# EAGLE design TPS6300x (EAGLE 6.2)
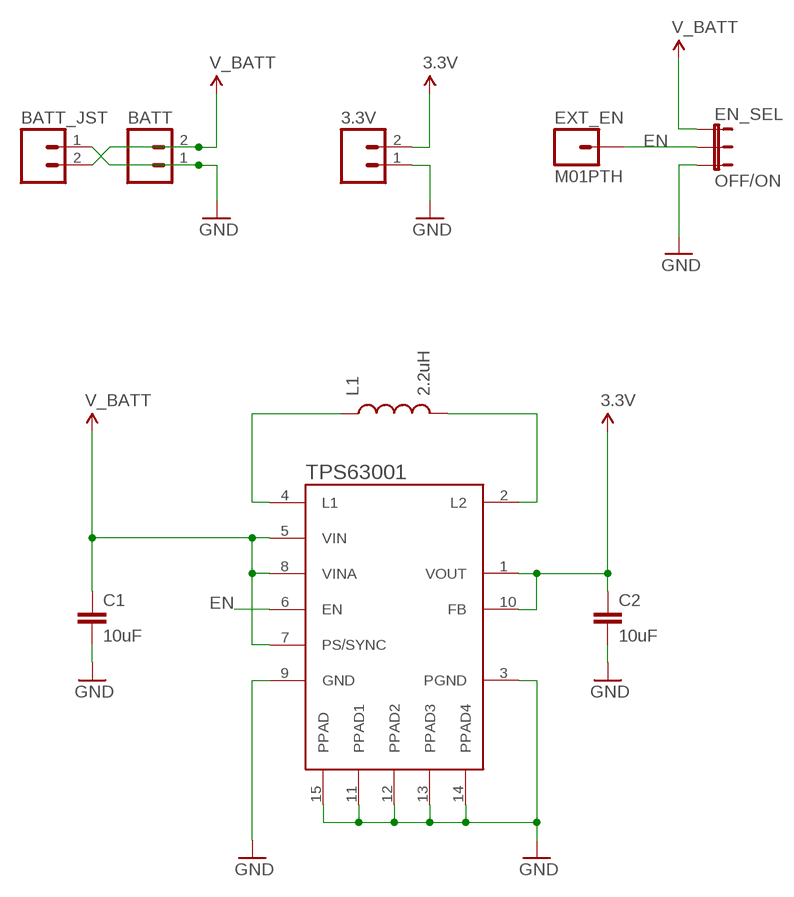
[diagram p0: schematic, sheet 1]

## Parts
3.3V  M02PTH  [1X02]
BATT  M02PTH  [1X02]
BATT_JST  M02-JST-2MM-SMT  [JST-2-SMD]
C1  10uF  CAP_CER-2012(0805)  [CAP-2012]
C2  10uF  CAP_CER-2012(0805)  [CAP-2012]
EN_SEL  OFF/ON  JUMPER-3SMD  [SJ_3]
EXT_EN  M01PTH  [1X01]
L1  2.2uH  INDUCTOR-VLF4012A  [INDUCTOR-VLF4012A]
TPS63001  TPS6300X  [QFN-10_PAD]

## Nets
1.8V: BATT.2 BATT_JST.2 C1.+ EN_SEL.1 TPS63001.5(VIN) TPS63001.7(PS/SYNC) TPS63001.8(VINA) ; supply symbol labelled V_BATT
3.3V: 3.3V.2 C2.+ TPS63001.1(VOUT) TPS63001.10(FB)
EN: EN_SEL.2 EXT_EN.1 TPS63001.6(EN)
GND: 3.3V.1 BATT.1 BATT_JST.1 C1.- C2.- EN_SEL.3 TPS63001.3(PGND) TPS63001.9(GND) TPS63001.11(PPAD1) TPS63001.12(PPAD2) TPS63001.13(PPAD3) TPS63001.14(PPAD4) TPS63001.15(PPAD)
N$1: L1.2 TPS63001.4(L1)
N$2: L1.1 TPS63001.2(L2)

## Library data of the parts
3.3V BATT BATT_JST = SparkFun-Connectors:M02: Header 2 Standard 2-pin 0.1" header. Use with straight break away headers (SKU : PRT-00116), right angle break away headers (PRT-00553), swiss pins (PRT-00743), machine pins (PRT-00117), and female headers (PRT-00115). Molex polarized connector foot print use with SKU : PRT-08233 with associated crimp pins and housings.
C1 C2 = OpenSpace:CAP_CER
EN_SEL = SparkFun-Passives:JUMPER-3
EXT_EN = SparkFun-Connectors:M01: Header 1 Standard 1-pin 0.1" header. Use with straight break away headers (SKU : PRT-00116), right angle break away headers (PRT-00553), swiss pins (PRT-00743), machine pins (PRT-00117), and female headers (PRT-00115).
L1 = OpenSpace:INDUCTOR
TPS63001 = OpenSpace:TPS6300X

## Board
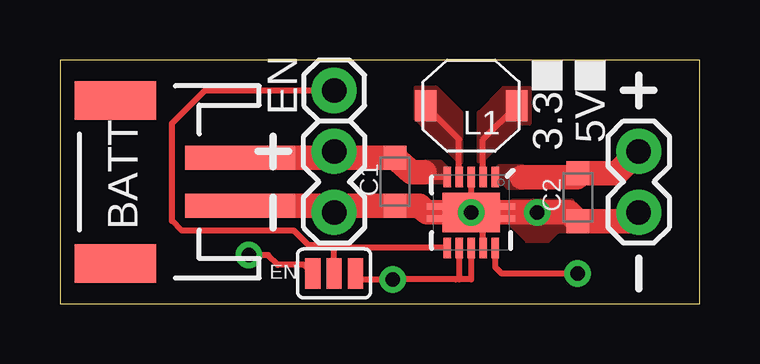
[diagram p1: board, top side]
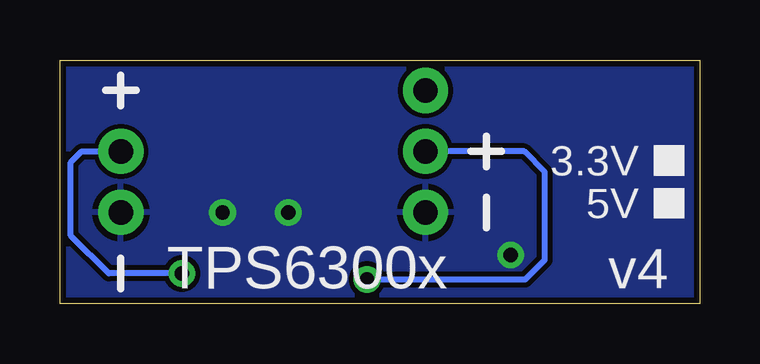
[diagram p2: board, bottom side, seen from below]

Size 26.67 x 10.16 mm. Coordinates in mm from the lower left corner, seen from the top.
Outline: 0,0 26.67,0 26.67,10.16 0,10.16 0,0
Copper layers (1*16): Top 0.035mm / dielectric 1.5mm / Bottom 0.035mm
Design rules: minimum track width 8mil, minimum drill 20mil, track to track 8mil, track to pad 8mil, pad to pad 8mil, via to via 8mil, smd to smd 8mil, copper to edge 10mil, drill to drill 8mil, minimum pad ring 12mil, minimum via ring 10mil, stop-mask expansion 4mil, vias tented up to drill 25mil, thermal gap 10mil

### Footprints (pad centres in the part's own frame; a part is rotated, then mirrored left to right if it is on the bottom)
1X02 = drill 1.016 pad 1.88: 1 0,0; 2 2.54,0
JST-2-SMD = smd 1 x 4.6: 1 -1,-3.7; 2 1,-3.7 | smd 1.6 x 3.4: NC1 -3.4,1.5; NC2 3.4,1.5
CAP-2012 = smd 1 x 0.95: + 1,0; - -1,0
SJ_3 = smd 0.635 x 1.27: 1 -0.889,0; 2 0,0; 3 0.889,0
1X01 = drill 1.016 pad 1.88: 1 0,0
INDUCTOR-VLF4012A = smd 0.9 x 1.3: 1 -1.9,0; 2 1.9,0
QFN-10_PAD = smd 0.297 x 0.85: 1 -1,-1.475; 2 -0.5,-1.475; 3 0,-1.475; 4 0.5,-1.475; 5 1,-1.475; 6 1,1.475; 7 0.5,1.475; 8 0,1.475; 9 -0.5,1.475; 10 -1,1.475 | smd 0.7 x 0.28: 11 -1.5,0.25; 12 -1.5,-0.25; 13 1.5,0.25; 14 1.5,-0.25 | smd 2.4 x 1.65: 15 0,0

### Placement (x,y rotation side)
3.3V  24.13,3.81 90 top
BATT  11.43,3.81 90 top
BATT_JST  3.81,5.08 90 top
C1  13.97,5.08 90 top
C2  21.59,4.45 90 top
EN_SEL  11.43,1.27 180 top
EXT_EN  11.43,8.89 0 top
L1  17.14,8.26 180 top
TPS63001  17.14,3.81 180 top

### Tracks (layer width: path | path; a pad name or v marks a point on that pad's centre or on a via)
1.8V  (via drill 0.6)
  Top 0.254: EN_SEL.1 12.57,1.02 v13.87,1.02 16.51,1.02 16.64,1.02 | TPS63001.5 15.39,5.29 15.19,5.49 | TPS63001.8 17.14,1.02 16.64,1.02 | TPS63001.7 16.64,1.02
  Top 1.016: BATT_JST.2 11.16,6.08 BATT.2 11.7,6.08 C1.+ 14.65,5.49 15.19,5.49
  Bottom 0.254: v13.87,1.02 7.26,1.02 6.45,1.83 6.45,5.49 7.32,6.35 BATT.2
  pour Top (no thermals): 16.05,5.08 15.24,5.08 15.24,5.89 15.85,5.89 16.05,5.69
3.3V  (via drill 0.6)
  Top 0.254: TPS63001.10 18.14,1.54 18.41,1.27 v21.59,1.27
  Top 1.016: 19.25,5.28 21.55,5.28 C2.+ 23.23,5.45 3.3V.2
  Bottom 0.254: 3.3V.2 25.76,6.35 26.21,5.89 26.21,2.85 24.64,1.27 v21.59,1.27
  pour Top (no thermals): 18.29,5.08 18.49,5.08 18.69,4.88 19.3,4.88 19.3,5.69 18.29,5.69
EN
  Top 0.254: EN_SEL.2 11.43,2.29 | 11.43,2.29 11.28,2.44 10.36,2.44 9.75,3.05 5.08,3.05 4.67,3.45 4.67,7.52 6.04,8.89 EXT_EN.1 | TPS63001.6 11.48,2.33 11.43,2.29
GND  (via drill 0.6)
  Top 0.254: TPS63001.3 TPS63001.15 | TPS63001.9 17.64,3.31 TPS63001.15 | TPS63001.11 17.39,3.56 TPS63001.15 | TPS63001.12 17.39,4.06 TPS63001.15 | TPS63001.13 16.89,3.56 TPS63001.15 | TPS63001.14 16.89,4.06 TPS63001.15 | EN_SEL.3 10.19,1.63 9.09,1.63 8.69,2.03 v7.87,2.03
  Top 1.016: BATT_JST.1 11.16,4.08 BATT.1 11.79,4.08 C1.- 14.99,4.08 14.99,4.06 15.3,3.81 TPS63001.15 v19.89,3.81 21.23,3.81 C2.- 24.13,3.44 3.3V.1
  other vias: 17.14,3.81
  pour Bottom: 0.2,9.96 26.42,9.96 26.42,0.2 0.2,0.2
  pour Top (no thermals): 21.34,3.05 20.73,3.05 20.32,2.64 19.51,2.64 18.9,3.25 18.9,4.27 21.34,4.27
N$1
  Top 0.254: TPS63001.4 16.64,6.86 L1.2
  pour Top (no thermals): 14.86,7.75 16.69,5.92 16.69,7.95 15.67,8.97 14.86,8.97
N$2
  Top 0.254: TPS63001.2 17.64,6.86 L1.1
  pour Top (no thermals): 19.53,7.54 19.13,7.54 17.5,5.92 17.5,7.95 18.52,8.97 19.53,8.97

### Text on the board
tPlace: 3.3 | 5V
bPlace: 3.3V | 5V | v4 | TPS6300x
tNames: EN | EN